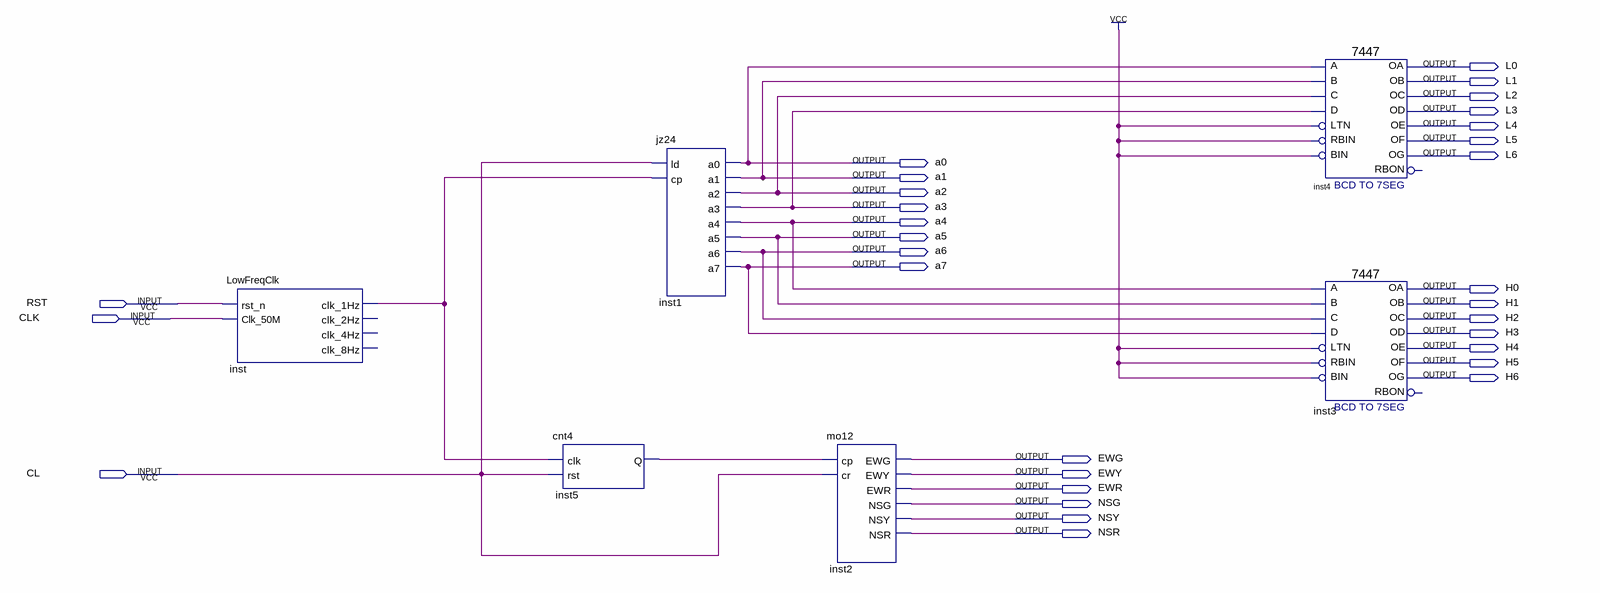
[diagram p0: schematic sheet]
// Quartus schematic Final.bdf as structural Verilog: 6 symbols, 31 pins
module Final (
  input  RST,
  input  CLK,
  input  CL,
  output L0,
  output L1,
  output L2,
  output L3,
  output L4,
  output L5,
  output L6,
  output a0,
  output a1,
  output a2,
  output a3,
  output a4,
  output a5,
  output a6,
  output a7,
  output H0,
  output H1,
  output H2,
  output H3,
  output H4,
  output H5,
  output H6,
  output EWG,
  output EWY,
  output EWR,
  output NSG,
  output NSY,
  output NSR
);

  wire inst5_q, inst_clk_1hz;

  LowFreqClk inst (.rst_n(RST), .Clk_50M(CLK), .clk_1Hz(inst_clk_1hz));  // open: clk_2Hz, clk_4Hz, clk_8Hz
  cnt4 inst5 (.clk(inst_clk_1hz), .rst(CL), .Q(inst5_q));
  jz24 inst1 (.ld(CL), .cp(inst_clk_1hz), .a0(a0), .a1(a1), .a2(a2), .a3(a3), .a4(a4), .a5(a5), .a6(a6), .a7(a7));
  mo12 inst2 (.cp(inst5_q), .cr(CL), .EWG(EWG), .EWY(EWY), .EWR(EWR), .NSG(NSG), .NSY(NSY), .NSR(NSR));
  \7447  inst4 (
    .LTN(1'b1), .B(a1), .C(a2), .D(a3), .RBIN(1'b1), .BIN(1'b1), .A(a0), .OB(L1), .OC(L2), .OE(L4), .OD(L3),
    .OF(L5), .OG(L6), .OA(L0));  // open: RBON
  \7447  inst3 (
    .LTN(1'b1), .B(a5), .C(a6), .D(a7), .RBIN(1'b1), .BIN(1'b1), .A(a4), .OB(H1), .OC(H2), .OE(H4), .OD(H3),
    .OF(H5), .OG(H6), .OA(H0));  // open: RBON
endmodule
